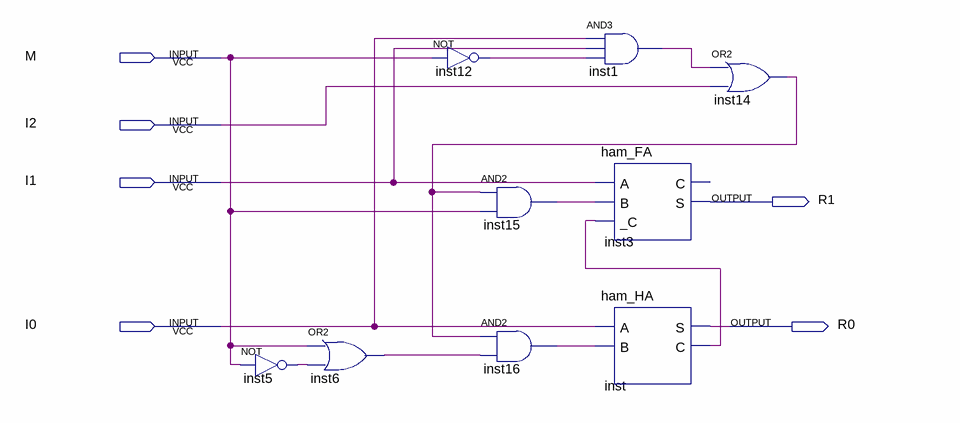
[diagram p0: schematic sheet]
// Quartus schematic ham_Modulo24.bdf as structural Verilog: 9 symbols, 6 pins
module ham_Modulo24 (
  input  M,
  input  I2,
  input  I1,
  input  I0,
  output R1,
  output R0
);

  wire inst1_out, inst5_out, inst6_out, inst12_out, inst14_out, inst15_out, inst16_out, inst_c;

  not inst5 (inst5_out, M);
  or inst6 (inst6_out, M, inst5_out);
  not inst12 (inst12_out, M);
  and inst15 (inst15_out, inst14_out, M);
  and inst16 (inst16_out, inst14_out, inst6_out);
  and inst1 (inst1_out, I0, I1, inst12_out);
  ham_FA inst3 (.A(I1), .B(inst15_out), ._C(inst_c), .S(R1));  // open: C
  ham_HA inst (.A(I0), .B(inst16_out), .S(R0), .C(inst_c));
  or inst14 (inst14_out, inst1_out, I2);
endmodule
